# Altium schematic sheet 02.SchDoc: Pickit 2
size 146 x 96 mm; SheetNumber: 2; SheetTotal: 3; PageSetup: Record=PageOptions|CenterHorizontal=True|CenterVertical=True|PrintScale=2.00|XCorrection=1.00|YCorrection=1.00|PrintKind=0|BorderSize=5000000|LeftOffset=0|BottomOffset=0|Orientation=2|PaperLength=1000|PaperWidth=1000|Scale=100|PaperSource=7|PrintQuality=-4|MediaType=1|DitherType=10|PaperKind=A4|PrintScaleMode=1
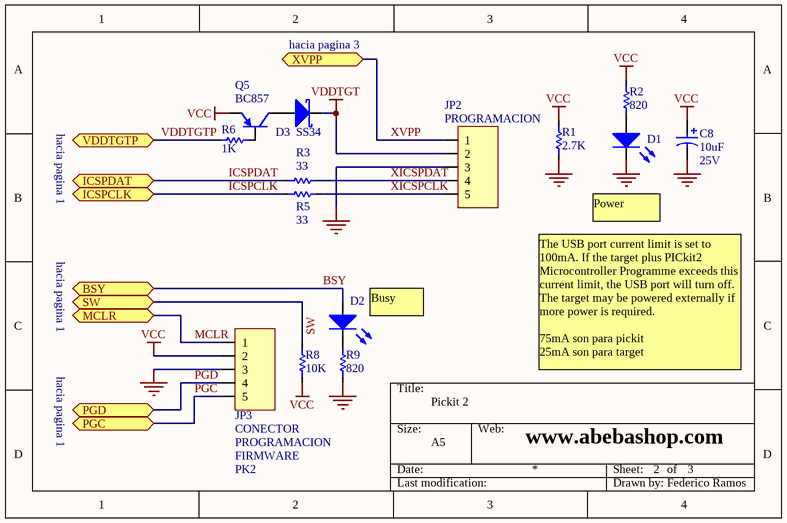
[diagram p0: 02.SchDoc]

## Parts
C8  value 10uF  Voltaje: 25V  [1206P]  (hidden comment: Cap Pol)
D1  LED  [1206P]  (value not drawn)
D2  LED  [1206P]  (value not drawn)
D3  SS34  [D64]
JP2  Price: PROGRAMACION  [HDR5x1]  (hidden comment: Header5x1)
JP3  Price: CONECTOR  [HDR5x1]  (hidden comment: Header5x1)
Q5  BC857  [SOT23]
R1  value 2.7K  [1206NP]  (hidden comment: Res)
R2  value 820  [1206NP]  (hidden comment: Res)
R3  value 33  [1206NP]  (hidden comment: Res)
R5  value 33  [1206NP]  (hidden comment: Res)
R6  value 1K  [1206NP]  (hidden comment: Res)
R8  value 10K  [1206NP]  (hidden comment: Res)
R9  value 820  [1206NP]  (hidden comment: Res)

## Ports
BSY, ICSPCLK, ICSPDAT, MCLR, PGC, PGD, SW, VDDTGTP, XVPP

## Nets
GND: C8.2 D1.2(K) JP2.3 JP3.3 R1.2 R9.1
VCC: C8.1 JP3.2 Q5.3(E) R1.1 R2.2 R8.2
VDDTGT: D3.2(K) JP2.2
BSY: D2.1(A) ; port BSY
ICSPCLK: R5.1 ; port ICSPCLK
ICSPDAT: R3.1 ; port ICSPDAT
MCLR: JP3.1 ; port MCLR
PGC: JP3.5 ; port PGC
PGD: JP3.4 ; port PGD
SW: R8.1 ; port SW
VDDTGTP: R6.2 ; port VDDTGTP
XICSPCLK: JP2.5 R5.2
XICSPDAT: JP2.4 R3.2
XVPP: JP2.1 ; port XVPP
NetD1_1: D1.1(A) R2.1
NetD2_2: D2.2(K) R9.2
NetD3_1: D3.1(A) Q5.1(C)
NetQ5_2: Q5.2(B) R6.1

## Notes on the sheet
- hacia pagina 3
- hacia pagina 1
- Power
- Busy
- The USB port current limit is set to 100mA. If the target plus PICkit2 Microcontroller Programme exceeds this current limit, the USB port will turn off. The target may be powered externally if more power is required.
  75mA son para pickit
  25mA son para target
- Title:
- Size:
- Date:
- A5
- Web:
- www.abebashop.com
- Sheet:
- of
- Last modification:
- Drawn by: Federico Ramos
- (in symbol Header5x1) PROGRAMACION; FIRMWARE; PK2

## Library data of the parts
C8 = Cap Pol: Capacitor Polarizado; Price: ?
D1 D2 = LED: Color: Green; Price: ?
D3 = 1N5822: Schottky Diode 3A 40V; Revision: July-2002: Re-released for DXP Platform.
JP2 JP3 = Header5x1: Header 5x1
Q5 = BC856A: 100mA 65V PNP Bipolar Transistor; pin to pad: 1>3 2>1 3>2; Price: 0.3267
R1-R3 R5 R6 R8 R9 = Res: Resistor; Power: 0.25W; Price: 0.036